# Altium schematic sheet CarteDetection With Multiplexor.SchDoc
size A4; PageSetup: Record=PageOptions|CenterHorizontal=True|CenterVertical=True|PrintScale=1.00|XCorrection=1.00|YCorrection=1.00|PrintKind=0|BorderSize=5000000|LeftOffset=0|BottomOffset=0|Orientation=2|PaperLength=1000|PaperWidth=1000|Scale=100|PaperSource=15|PrintQuality=600|MediaType=1|DitherType=1|PaperKind=A4|PrintScaleMode=1
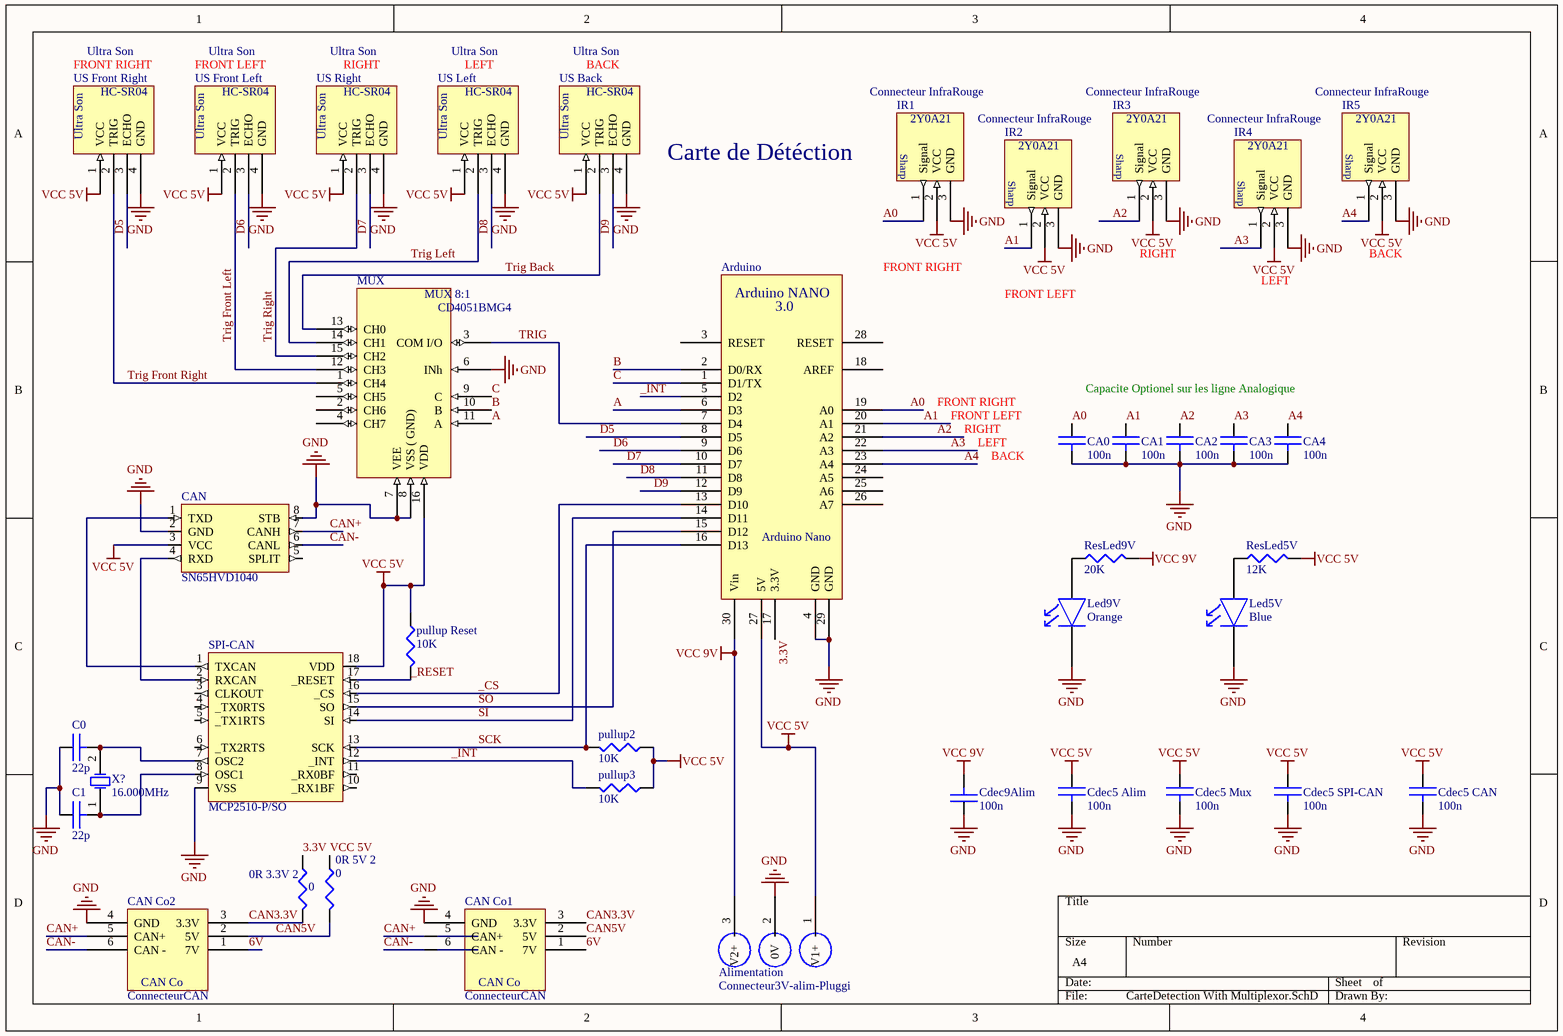
[diagram p0: CarteDetection With Multiplexor.SchDoc]

## Parts
0R_3.3V_2  value 0  [0805]  (hidden comment: RES)
0R_5V_2  value 0  [0805]  (hidden comment: RES)
Alimentation  Connecteur3V-alim-Pluggi  [CONNECTEUR3V-ALIM-PLUGGI]
Arduino  Arduino Nano  [Arduino Nano FootPrint]
C0  value 22p  [0805]  (hidden comment: CAP)
C1  value 22p  [0805]  (hidden comment: CAP)
CA0  value 100n  [0805]  (hidden comment: CAP)
CA1  value 100n  [0805]  (hidden comment: CAP)
CA2  value 100n  [0805]  (hidden comment: CAP)
CA3  value 100n  [0805]  (hidden comment: CAP)
CA4  value 100n  [0805]  (hidden comment: CAP)
CAN  SN65HVD1040  [SO8]
CAN_Co1  ConnecteurCAN  [CAN Connecteur]
CAN_Co2  ConnecteurCAN  [CAN Connecteur]
Cdec5_Alim  value 100n  [0805]  (hidden comment: CAP)
Cdec5_CAN  value 100n  [0805]  (hidden comment: CAP)
Cdec5_Mux  value 100n  [0805]  (hidden comment: CAP)
Cdec5_SPI-CAN  value 100n  [0805]  (hidden comment: CAP)
Cdec9Alim  value 100n  [0805]  (hidden comment: CAP)
IR1  Connecteur InfraRouge  [Connecteur InfraRouge]
IR2  Connecteur InfraRouge  [Connecteur InfraRouge]
IR3  Connecteur InfraRouge  [Connecteur InfraRouge]
IR4  Connecteur InfraRouge  [Connecteur InfraRouge]
IR5  Connecteur InfraRouge  [Connecteur InfraRouge]
Led5V  Blue  [LED5]
Led9V  Orange  [LED5]
MUX  MUX 8:1 CD4051B  [MUX 8:1*]  (value not drawn)
pullup2  value 10K  [0805]  (hidden comment: RES)
pullup3  value 10K  [0805]  (hidden comment: RES)
pullup_Reset  value 10K  [0805]  (hidden comment: RES)
ResLed5V  value 12K  [0805]  (hidden comment: RES)
ResLed9V  value 20K  [0805]  (hidden comment: RES)
SPI-CAN  MCP2510-P/SO  [DIP18]
US_Back  Ultra Son  [Conecteur UltraSon]
US_Front_Left  Ultra Son  [Conecteur UltraSon]
US_Front_Right  Ultra Son  [Conecteur UltraSon]
US_Left  Ultra Son  [Conecteur UltraSon]
US_Right  Ultra Son  [Conecteur UltraSon]
X?  16.000MHz  [HC5U]

## Nets
GND: Alimentation.2(0V) Arduino.4(GND) Arduino.29(GND) C0.1 C1.1 CA0.2 CA1.2 CA2.2 CA3.2 CA4.2 CAN.2(GND) CAN.8(STB) CAN_Co1.4(GND) CAN_Co2.4(GND) Cdec5_Alim.2 Cdec5_CAN.2 Cdec5_Mux.2 Cdec5_SPI-CAN.2 Cdec9Alim.1 IR1.3(GND) IR2.3(GND) IR3.3(GND) IR4.3(GND) IR5.3(GND) Led5V.K Led9V.K MUX.6(INh) MUX.7(VEE) MUX.8(VSS_(_GND)) SPI-CAN.9(VSS) US_Back.4(GND) US_Front_Left.4(GND) US_Front_Right.4(GND) US_Left.4(GND) US_Right.4(GND)
VCC 5V: 0R_5V_2.1 Alimentation.1(V1+) Arduino.27(5V) CAN.3(VCC) Cdec5_Alim.1 Cdec5_CAN.1 Cdec5_Mux.1 Cdec5_SPI-CAN.1 IR1.2(VCC) IR2.2(VCC) IR3.2(VCC) IR4.2(VCC) IR5.2(VCC) MUX.16(VDD) pullup2.1 pullup3.1 pullup_Reset.1 ResLed5V.2 SPI-CAN.18(VDD) US_Back.1(VCC) US_Front_Left.1(VCC) US_Front_Right.1(VCC) US_Left.1(VCC) US_Right.1(VCC)
VCC 9V: Alimentation.3(V2+) Arduino.30(Vin) Cdec9Alim.2 ResLed9V.2
3.3V: 0R_3.3V_2.1 Arduino.17(3.3V)
6V: CAN_Co1.1(7V) CAN_Co2.1(7V)
_CS: Arduino.13(D10) SPI-CAN.16(_CS)
_INT: Arduino.5(D2) pullup3.2 SPI-CAN.12(_INT)
_RESET: pullup_Reset.2 SPI-CAN.17(_RESET)
A: Arduino.6(D3) MUX.11(A)
A0: Arduino.19(A0) CA0.1 IR1.1(Signal)
A1: Arduino.20(A1) CA1.1 IR2.1(Signal)
A2: Arduino.21(A2) CA2.1 IR3.1(Signal)
A3: Arduino.22(A3) CA3.1 IR4.1(Signal)
A4: Arduino.23(A4) CA4.1 IR5.1(Signal)
B: Arduino.2(D0/RX) MUX.10(B)
C: Arduino.1(D1/TX) MUX.9(C)
CAN3.3V: 0R_3.3V_2.2 CAN_Co1.3(3.3V) CAN_Co2.3(3.3V)
CAN5V: 0R_5V_2.2 CAN_Co1.2(5V) CAN_Co2.2(5V)
CAN+: CAN.7(CANH) CAN_Co1.5(CAN+) CAN_Co2.5(CAN+)
CAN-: CAN.6(CANL) CAN_Co1.6(CAN_-) CAN_Co2.6(CAN_-)
D5: Arduino.8(D5) US_Front_Right.3(ECHO)
D6: Arduino.9(D6) US_Front_Left.3(ECHO)
D7: Arduino.10(D7) US_Right.3(ECHO)
D8: Arduino.11(D8) US_Left.3(ECHO)
D9: Arduino.12(D9) US_Back.3(ECHO)
SCK: Arduino.16(D13) pullup2.2 SPI-CAN.13(SCK)
SI: Arduino.14(D11) SPI-CAN.14(SI)
SO: Arduino.15(D12) SPI-CAN.15(SO)
TRIG: Arduino.7(D4) MUX.3(COM_I/O)
Trig Back: MUX.13(CH0) US_Back.2(TRIG)
Trig Front Left: MUX.12(CH3) US_Front_Left.2(TRIG)
Trig Front Right: MUX.1(CH4) US_Front_Right.2(TRIG)
Trig Left: MUX.14(CH1) US_Left.2(TRIG)
Trig Right: MUX.15(CH2) US_Right.2(TRIG)
NetC0_2: C0.2 SPI-CAN.7(OSC2) X?.2(OSC2)
NetC1_2: C1.2 SPI-CAN.8(OSC1) X?.1(OSC1)
NetCAN_1: CAN.1(TXD) SPI-CAN.1(TXCAN)
NetCAN_4: CAN.4(RXD) SPI-CAN.2(RXCAN)
NetLed5V_A: Led5V.A ResLed5V.1
NetLed9V_A: Led9V.A ResLed9V.1

Not connected (* = marked no-connect by the designer): Arduino 3(RESET) 18(AREF) 24(A5) 25(A6) 26(A7) 28(RESET); CAN 5(SPLIT); MUX 2(CH6) 4(CH7) 5(CH5); SPI-CAN 3(CLKOUT) 4(_TX0RTS) 5(_TX1RTS) 6(_TX2RTS) 10(_RX1BF) 11(_RX0BF)

## Notes on the sheet
- FRONT RIGHT
- FRONT LEFT
- RIGHT
- LEFT
- BACK
- Carte de Détéction
- Capacite Optionel sur les ligne Analogique
- (in symbol Arduino Nano) Arduino NANO; 3.0
- (in symbol Connecteur InfraRouge) 2Y0A21; Sharp
- (in symbol ConnecteurCAN) CAN Co
- (in symbol MUX 8:1 CD4051B) MUX 8:1; CD4051BMG4
- (in symbol Ultra Son) HC-SR04

## Library data of the parts
0R_3.3V_2 0R_5V_2 pullup2 pullup3 pullup_Reset ResLed5V ResLed9V = RES: resistance
C0 C1 CA0-CA4 Cdec5_Alim Cdec5_CAN Cdec5_Mux Cdec5_SPI-CAN Cdec9Alim = CAP: capacité non polarisée
Led5V Led9V = LED: LED 5mm/3mm/CMS
SPI-CAN = MCP2510-P/SO: CAN controler
X? = XTAL: Quartz; Manufacturer: Generic Components; Class I: Oscillator; Class II: Crystal Oscillator; Published: 8-Jun-2000; Revision: July-2002: Re-released for DXP Platform.; Publisher: Altium Limited